# Altium schematic sheet CPU.SchDoc
size A4
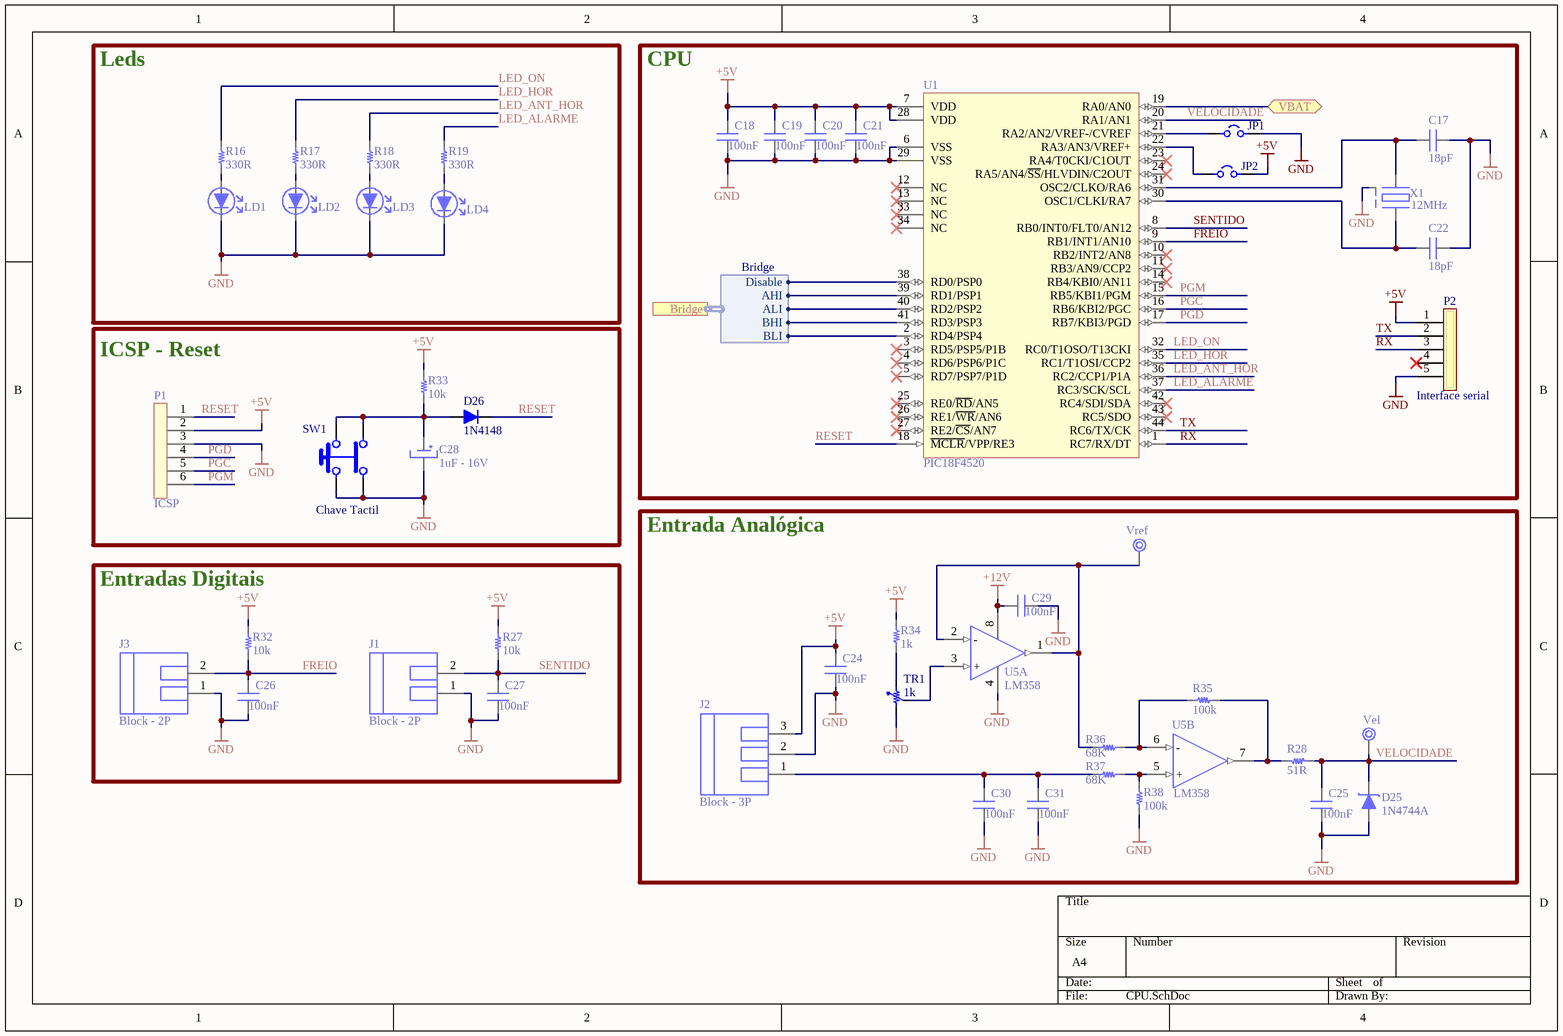
[diagram p0: CPU.SchDoc]

## Parts
C17  18pF  [Capacitor_0805]
C18  100nF  [Capacitor_0805]
C19  100nF  [Capacitor_0805]
C20  100nF  [Capacitor_0805]
C21  100nF  [Capacitor_0805]
C22  18pF  [Capacitor_0805]
C24  100nF  [Capacitor_0805]
C25  100nF  [Capacitor_0805]
C26  100nF  [Capacitor_0805]
C27  100nF  [Capacitor_0805]
C28  1uF - 16V  [CAP_8x5mm]
C29  100nF  [Capacitor_0805]
C30  100nF  [Capacitor_0805]
C31  100nF  [Capacitor_0805]
D25  1N4744A  [Diode_PHT]
D26  1N4148  [SOD-80]
J1  Block - 2P  [CONECTOR_2P_2PARTES]
J2  Block - 3P  [CONECTOR_3P_2PARTES]
J3  Block - 2P  [CONECTOR_2P_2PARTES]
JP1  Jumper  [JUMPER]  (value not drawn)
JP2  Jumper  [JUMPER]  (value not drawn)
LD1  Led  [Led 5mm]  (value not drawn)
LD2  Led  [Led 5mm]  (value not drawn)
LD3  Led  [Led 5mm]  (value not drawn)
LD4  Led  [Led 5mm]  (value not drawn)
P1  ICSP  [header 1x6]
P2  Interface serial  [HEADER 1X5]
R16  330R  [R_0805]
R17  330R  [R_0805]
R18  330R  [R_0805]
R19  330R  [R_0805]
R27  10k  [R_0805]
R28  51R  [R_0805]
R32  10k  [R_0805]
R33  10k  [R_0805]
R34  1k  [R_0805]
R35  100k  [R_0805]
R36  68K  [R_0805]
R37  68K  [R_0805]
R38  100k  [R_0805]
SW1  Chave Tactil  [CHAVE TACTIL]
TR1  1k  [Trimpot]
U1  PIC18F4520  [TQFP-PT44]
U5  LM358  [SOP8]  (parts A,B of 2)
Vel  +12V  [TEST_POINT]  (value not drawn)
Vref  +12V  [TEST_POINT]  (value not drawn)
X1  12MHz  [Crystal_3Pins - 4,98mm]

## Blocks framed on the sheet
Leds: LD1-LD4 R16-R19
CPU: C17-C22 JP1 JP2 P2 U1 X1
ICSP - Reset: C28 D26 P1 R33 SW1
Entrada Analógica: C24 C25 C29-C31 D25 J2 R28 R34-R38 TR1 U5 Vel Vref
Entradas Digitais: C26 C27 J1 J3 R27 R32

## Ports
Bridge (harness Bridge), VBAT (bidir)

## Harnesses
Bridge: Disable, AHI, ALI, BHI, BLI

## Nets
+5V: C18.2 C19.2 C20.2 C21.2 C24.2 J2.3 JP2.2 P1.2 P2.1 R27.2 R32.2 R33.2 R34.1 U1.7(VDD) U1.28(VDD)
+12V: C29.2 U5.8(VCC)
GND: C17.1 C18.1 C19.1 C20.1 C21.1 C22.1 C24.1 C25.1 C26.1 C27.1 C28.2 C29.1 C30.1 C31.1 D25.A(Anodo) J1.1 J2.2 J3.1 JP1.2 LD1.1(Catodo) LD2.1(Catodo) LD3.1(Catodo) LD4.1(Catodo) P1.3 P2.5 R38.1 SW1.1 SW1.2 TR1.3 U1.6(VSS) U1.29(VSS) U5.4(VDD) X1.3(GND)
FREIO: C26.2 J3.2 R32.1 U1.9(RB1/INT1/AN10)
LED_ALARME: R19.2 U1.37(RC3/SCK/SCL)
LED_ANT_HOR: R18.2 U1.36(RC2/CCP1/P1A)
LED_HOR: R17.2 U1.35(RC1/T1OSI/CCP2)
LED_ON: R16.2 U1.32(RC0/T1OSO/T13CKI)
PGC: P1.5 U1.16(RB6/KBI2/PGC)
PGD: P1.4 U1.17(RB7/KBI3/PGD)
PGM: P1.6 U1.15(RB5/KBI1/PGM)
RESET: D26.1(Catodo) P1.1 U1.18(~{MCLR}/VPP/RE3)
RX: P2.3 U1.1(RC7/RX/DT)
SENTIDO: C27.2 J1.2 R27.1 U1.8(RB0/INT0/FLT0/AN12)
TX: P2.2 U1.44(RC6/TX/CK)
VBAT: U1.19(RA0/AN0) ; port VBAT
VELOCIDADE: C25.2 D25.K(Catodo) R28.2 U1.20(RA1/AN1) Vel.1
NetC17_2: C17.2 U1.31(OSC2/CLKO/RA6) X1.1
NetC22_2: C22.2 U1.30(OSC1/CLKI/RA7) X1.2
NetC28_1: C28.1 D26.2(Anodo) R33.1 SW1.3 SW1.4
NetC30_2: C30.2 C31.2 J2.1 R37.2
NetJP1_1: JP1.1 U1.21(RA2/AN2/VREF-/CVREF)
NetJP2_1: JP2.1 U1.22(RA3/AN3/VREF+)
NetLD1_2: LD1.2(Anodo) R16.1
NetLD2_2: LD2.2(Anodo) R17.1
NetLD3_2: LD3.2(Anodo) R18.1
NetLD4_2: LD4.2(Anodo) R19.1
NetR28_1: R28.1 R35.1 U5.7(OUT-1)
NetR34_2: R34.2 TR1.1
NetR35_2: R35.2 R36.1 U5.6(-)
NetR36_2: R36.2 U5.1(OUT-1) U5.2(-) Vref.1
NetR37_1: R37.1 R38.2 U5.5(+)
NetTR1_2: TR1.2 U5.3(+)
NetU1_2: U1.2(RD4/PSP4) ; port Bridge.BLI
NetU1_38: U1.38(RD0/PSP0) ; port Bridge.Disable
NetU1_39: U1.39(RD1/PSP1) ; port Bridge.AHI
NetU1_40: U1.40(RD2/PSP2) ; port Bridge.ALI
NetU1_41: U1.41(RD3/PSP3) ; port Bridge.BHI

Not connected (* = marked no-connect by the designer): P2 4*; U1 3(RD5/PSP5/P1B)* 4(RD6/PSP6/P1C)* 5(RD7/PSP7/P1D)* 10(RB2/INT2/AN8)* 11(RB3/AN9/CCP2)* 12(NC)* 13(NC)* 14(RB4/KBI0/AN11)* 23(RA4/T0CKI/C1OUT)* 24(RA5/AN4/~{SS}/HLVDIN/C2OUT)* 25(RE0/~{RD}/AN5)* 26(RE1/~{WR}/AN6)* 27(RE2/~{CS}/AN7)* 33(NC)* 34(NC)* 42(RC4/SDI/SDA)* 43(RC5/SDO)*

## Library data of the parts
C17 C22 = Cap0805_100nF: Capacitor C0805 18pF
C18-C21 C24-C27 C29-C31 = Cap0805_100nF: Capacitor C0805 100nF Desacoplamento
C28 = 1uF - 16V: Capacitor_1uF_16V; ComponentLink1Description: Datasheet; ComponentLink1URL: https://industrial.panasonic.com/cdbs/www-data/pdf/RDF0000/ABA0000C1209.pdf; Supplier 2: Mouser; Supplier Part Number 1: P11276-ND; Supplier Part Number 2: 667-EEU-FC1J681S; Supplier 1: Digi-Key
D25 = 1N4744A: Diodo Zener 15V 200mA; ComponentLink1Description: Datasheet; ComponentLink1URL: https://www.diodes.com/assets/Datasheets/ds25002.pdf; Supplier 1: Mouser; Supplier Part Number 1: 821-1N4744A
D26 = 1N4148: Diodo de uso geral; ComponentLink1Description: Datasheet; ComponentLink1URL: https://www.diodes.com/assets/Datasheets/ds25002.pdf; Supplier 1: Mouser; Supplier Part Number 1: 821-1N4744A
J1 J3 = Block - 2P: Conector block 2 pinos 2 peças
J2 = Block - 3P: Conector block 3 pinos 2 peças
JP1 JP2 = Jumper: Jumper de solda
LD1-LD4 = Led: Led padrão PTH ou SMD
P1 = ICSP: Conector ICSP para programação e debugger do PIC; Supplier 1: Farnell; Supplier Part Number 1: 1766161
P2 = Header 1x5: Header 1x5 2.56mm
R16-R19 = Resistor_330R: Resistor padrão 0805; Supplier 1: Digi-Key; Supplier Part Number 1: 541-150ADKR-ND
R27 R28 R32-R38 = Resistor_10K: Resistor padrão 0805; Supplier 1: Mouser; Supplier 2: Digi-Key; Supplier Part Number 1: 603-RC0805FR-0710KL; Supplier Part Number 2: 311-10.0KCRCT-ND
TR1 = Trimpot: Trimpot 1k; Supplier 1: Mouser; Supplier 2: Digi-Key; Supplier Part Number 1: 603-RC0805FR-0710KL; Supplier Part Number 2: 311-10.0KCRCT-ND
U1 = PIC18F4520: Microcontrolador de 8 bits da família PIC; Supplier 1: Digi-Key; Supplier 2: Mouser; Supplier Part Number 1: PIC18F4520-I/PT-ND; Supplier Part Number 2: 579-PIC18F4520-I/PT
U5 = LM358: LMx58-N Low-Power, Dual-Operational Amplifiers; ComponentLink1Description: Datasheet; ComponentLink1URL: http://www.ti.com/lit/ds/symlink/lm158-n.pdf
Vel Vref = test_point
X1 = Crystal: Crystal Genérico